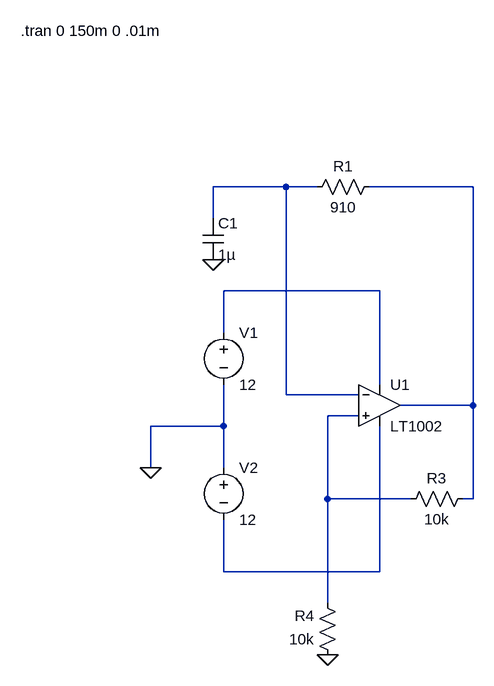
[diagram p0: schematic cuadrada3.asc]
cuadrada3.asc, the LTspice schematic file:
Version 4
SHEET 1 888 680
WIRE 16 -144 -96 -144
WIRE 64 -144 16 -144
WIRE 304 -144 144 -144
WIRE -96 -96 -96 -144
WIRE 160 16 -80 16
WIRE -80 80 -80 16
WIRE 160 160 160 16
WIRE 16 176 16 -144
WIRE 128 176 16 176
WIRE 304 192 304 -144
WIRE 304 192 192 192
WIRE 128 208 80 208
WIRE -80 224 -80 160
WIRE -80 224 -192 224
WIRE -192 288 -192 224
WIRE -80 288 -80 224
WIRE 80 336 80 208
WIRE 208 336 80 336
WIRE 304 336 304 192
WIRE 304 336 288 336
WIRE -80 448 -80 368
WIRE 160 448 160 224
WIRE 160 448 -80 448
WIRE 80 496 80 336
FLAG -192 288 0
FLAG -96 -32 0
FLAG 80 576 0
SYMBOL voltage -80 64 R0
WINDOW 123 0 0 Left 2
WINDOW 39 0 0 Left 2
SYMATTR InstName V1
SYMATTR Value 12
SYMBOL voltage -80 272 R0
WINDOW 123 0 0 Left 2
WINDOW 39 0 0 Left 2
SYMATTR InstName V2
SYMATTR Value 12
SYMBOL res 160 -160 R90
WINDOW 0 0 56 VBottom 2
WINDOW 3 32 56 VTop 2
SYMATTR InstName R1
SYMATTR Value 910
SYMBOL cap -112 -96 R0
SYMATTR InstName C1
SYMATTR Value 1µ
SYMBOL res 304 320 R90
WINDOW 0 0 56 VBottom 2
WINDOW 3 32 56 VTop 2
SYMATTR InstName R3
SYMATTR Value 10k
SYMBOL res 96 592 R180
WINDOW 0 36 76 Left 2
WINDOW 3 36 40 Left 2
SYMATTR InstName R4
SYMATTR Value 10k
SYMBOL Opamps\\LT1002 160 128 R0
SYMATTR InstName U1
TEXT -392 -384 Left 2 !.tran 0 150m 0 .01m

The netlist it stands for:
* cuadrada3.asc
V1 N003 0 12
V2 0 N005 12
R1 N002 N001 910
C1 N001 0 1µ
R3 N002 N004 10k
R4 0 N004 10k
XU1 N004 N001 N003 N005 N002 LT1002  ; pins In+ In- V+ V- OUT
.tran 0 150m 0 .01m
.backanno
.end